# Altium schematic sheet Sheet4_Matrix.SchDoc
size A0
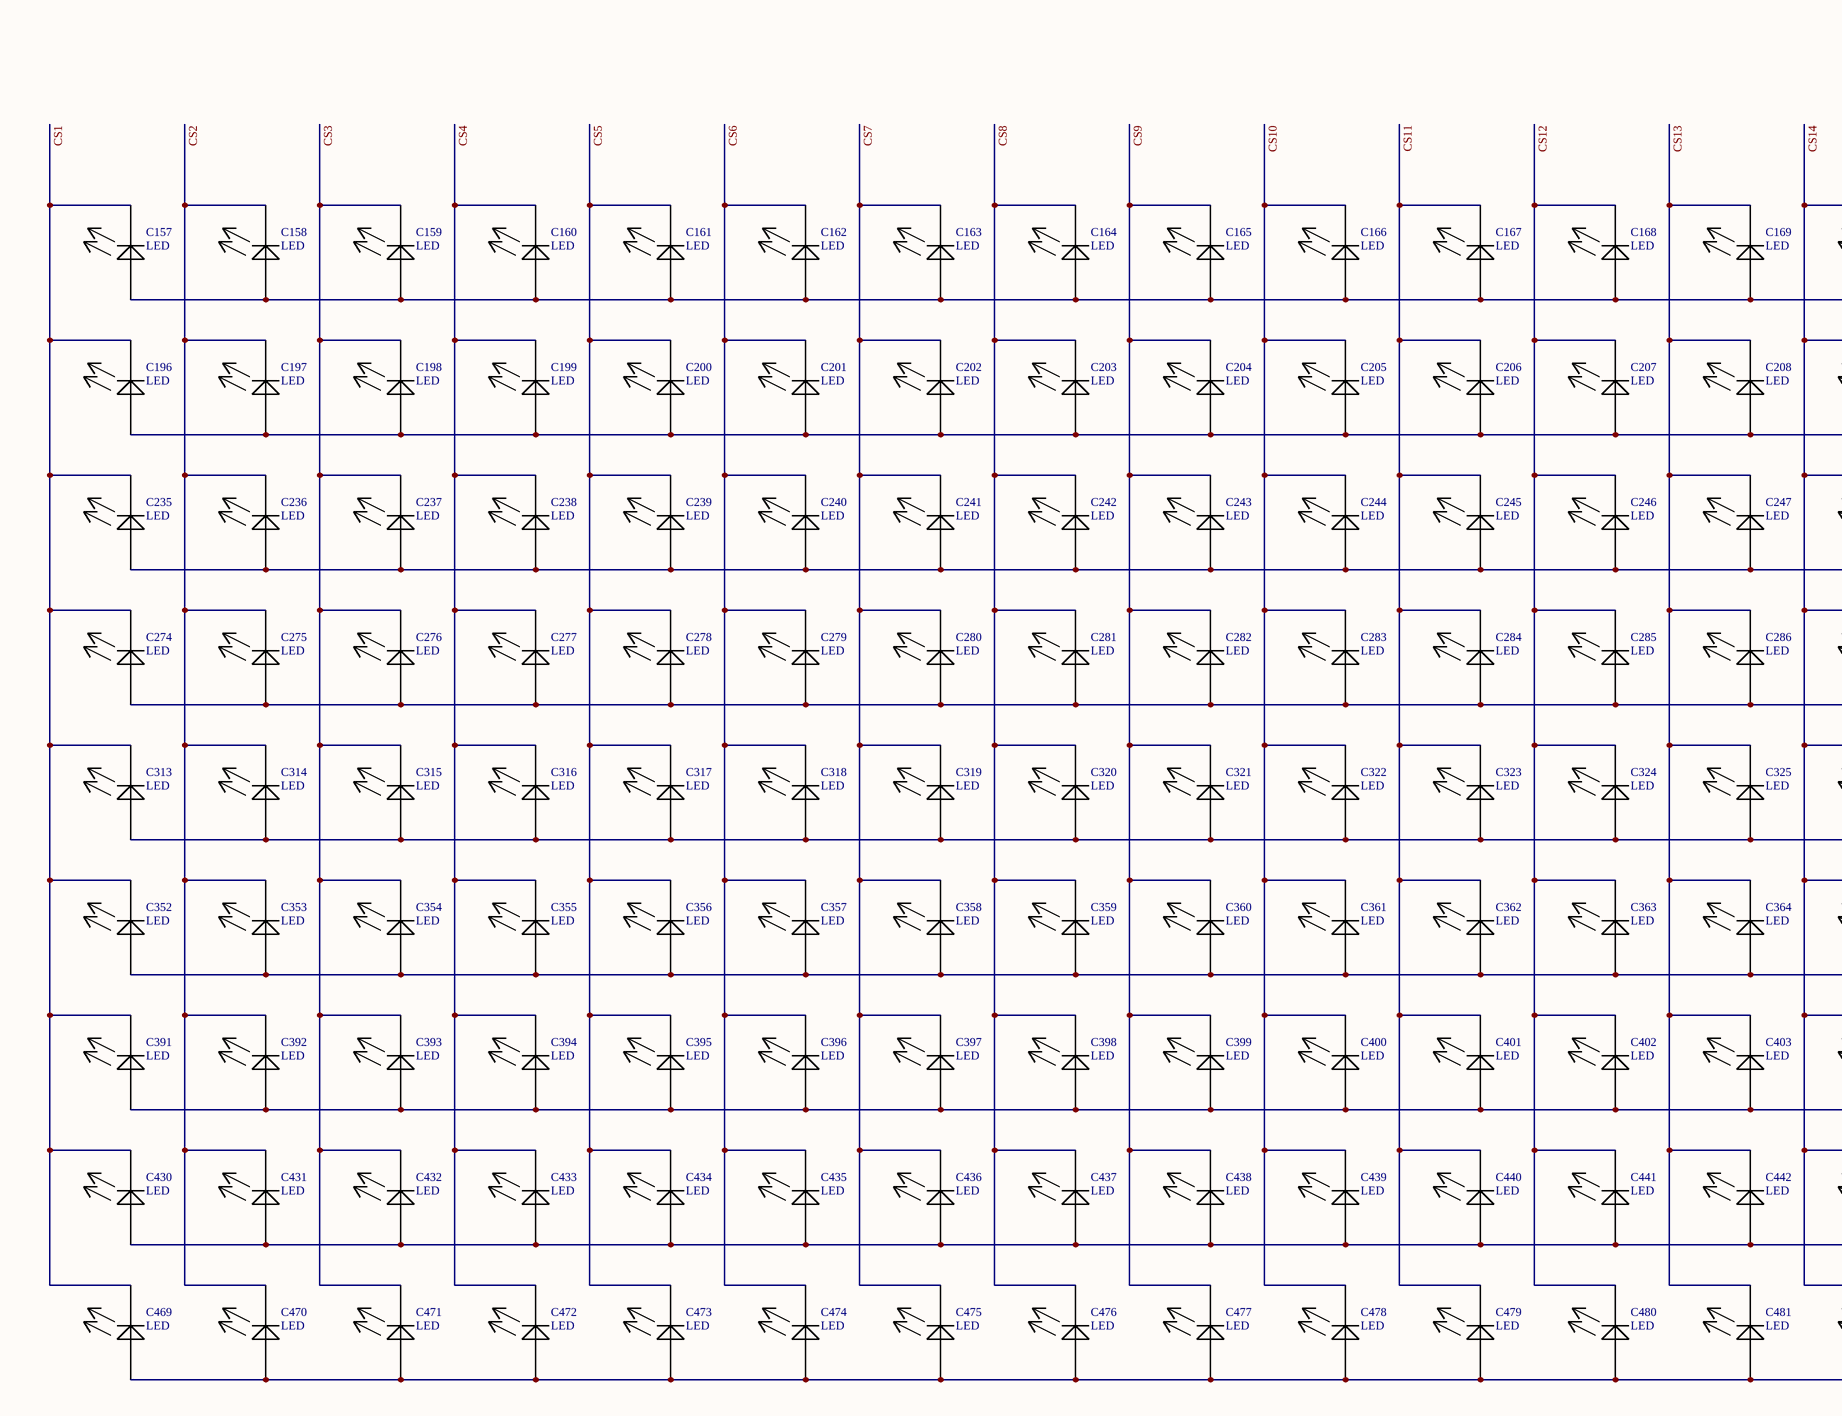
[diagram p0: Sheet4_Matrix.SchDoc, left]
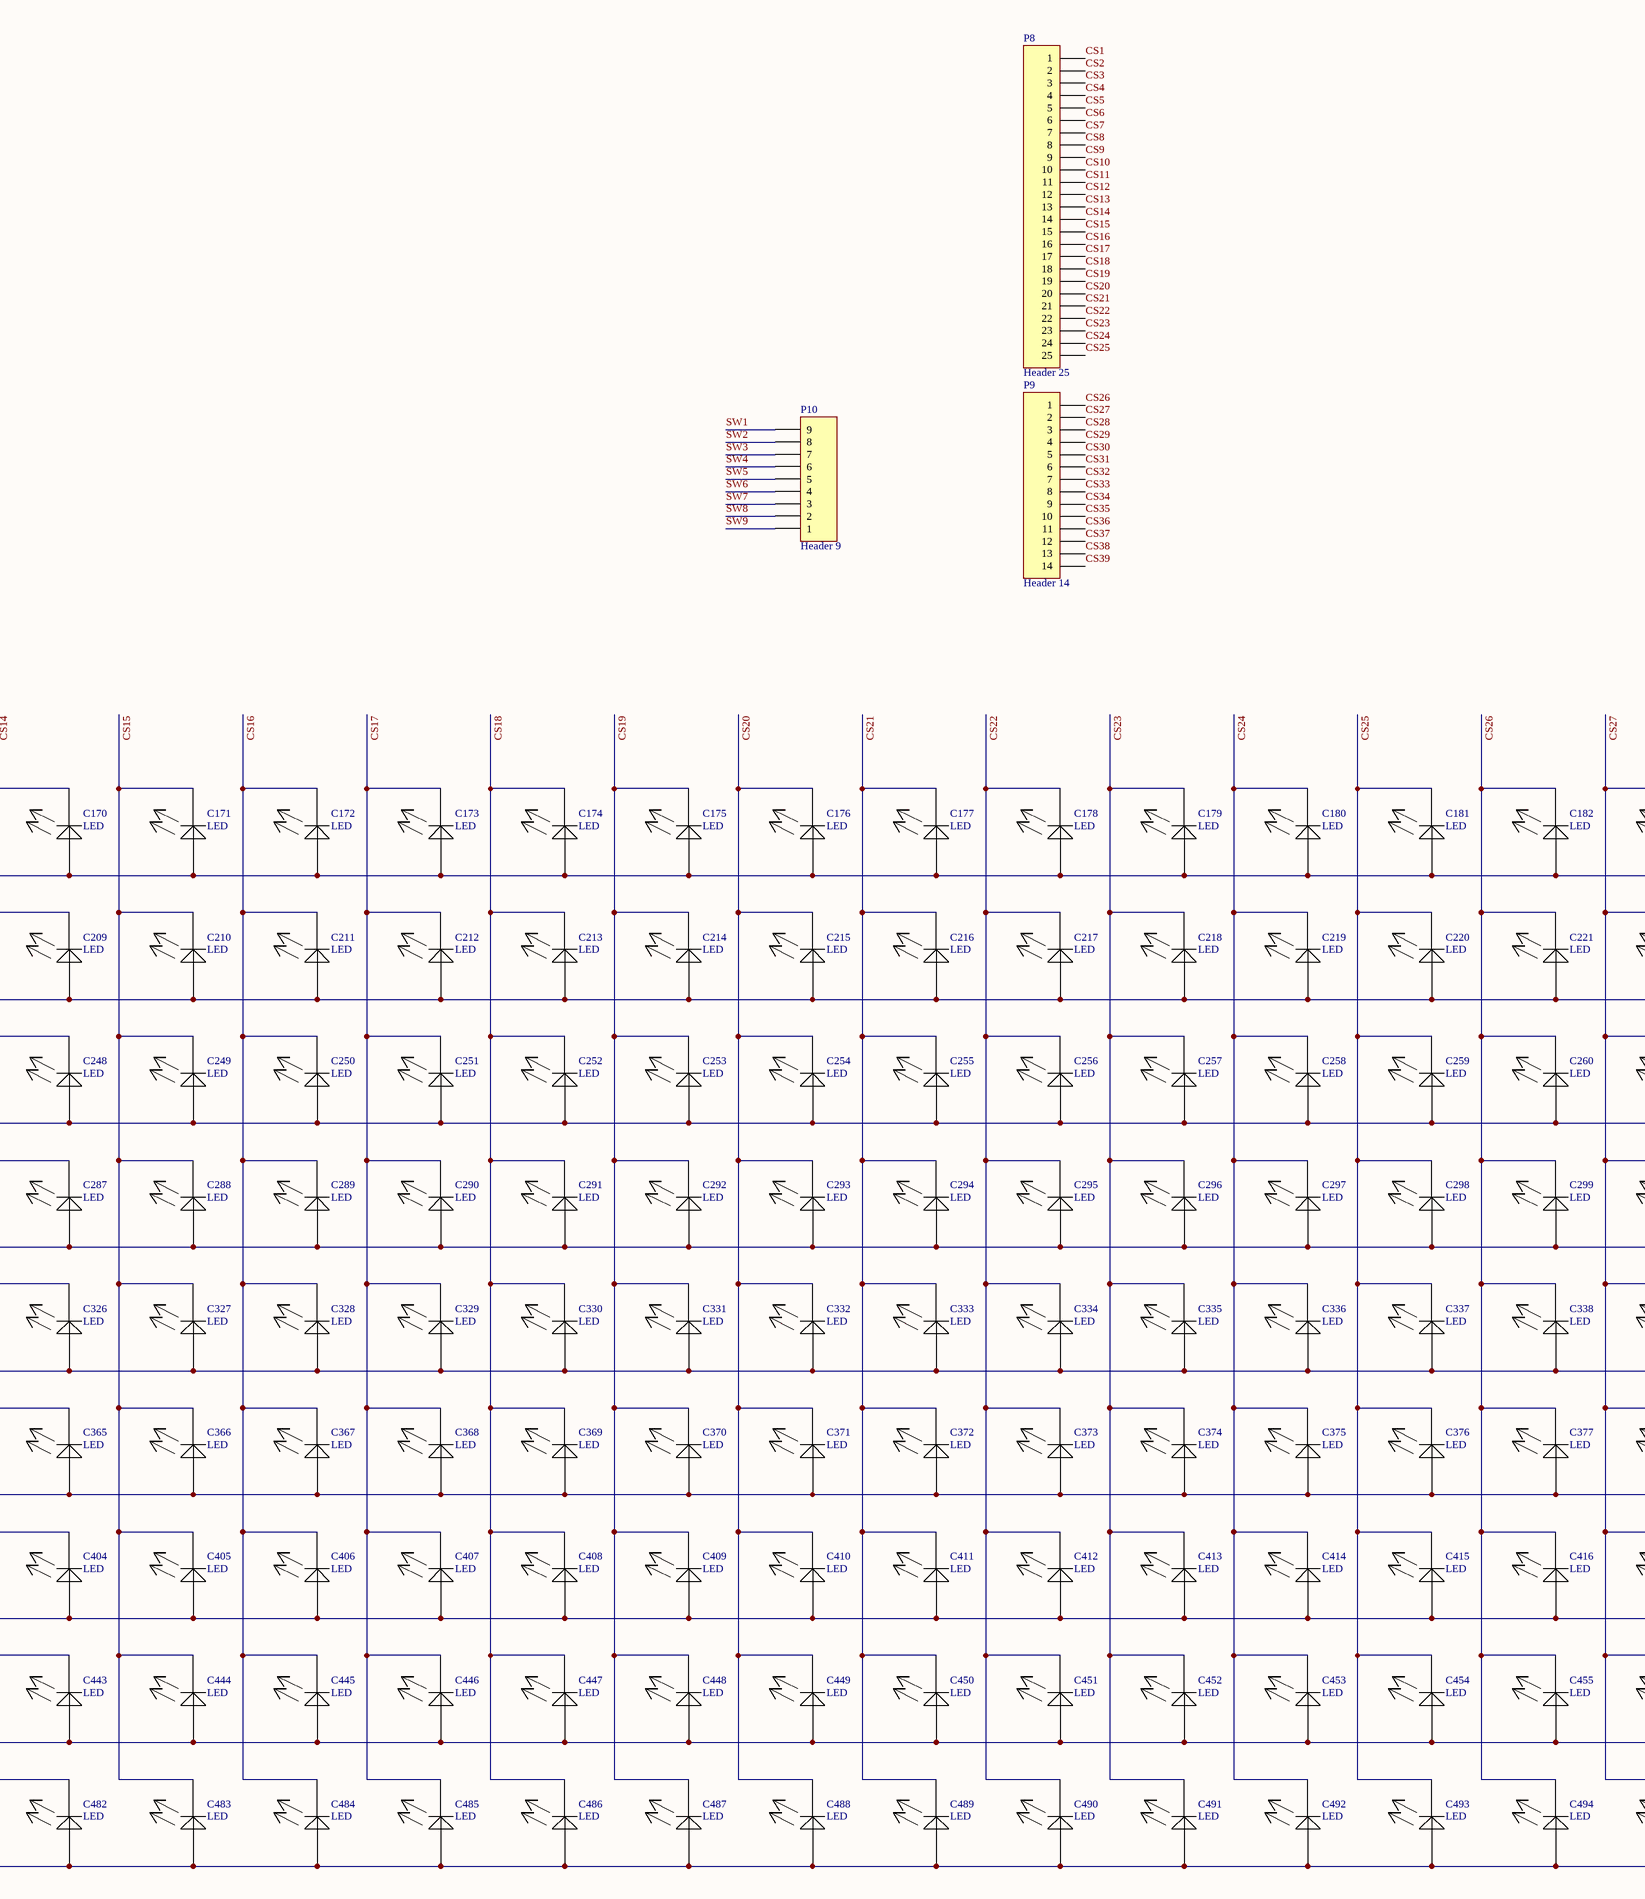
[diagram p1: Sheet4_Matrix.SchDoc, middle]
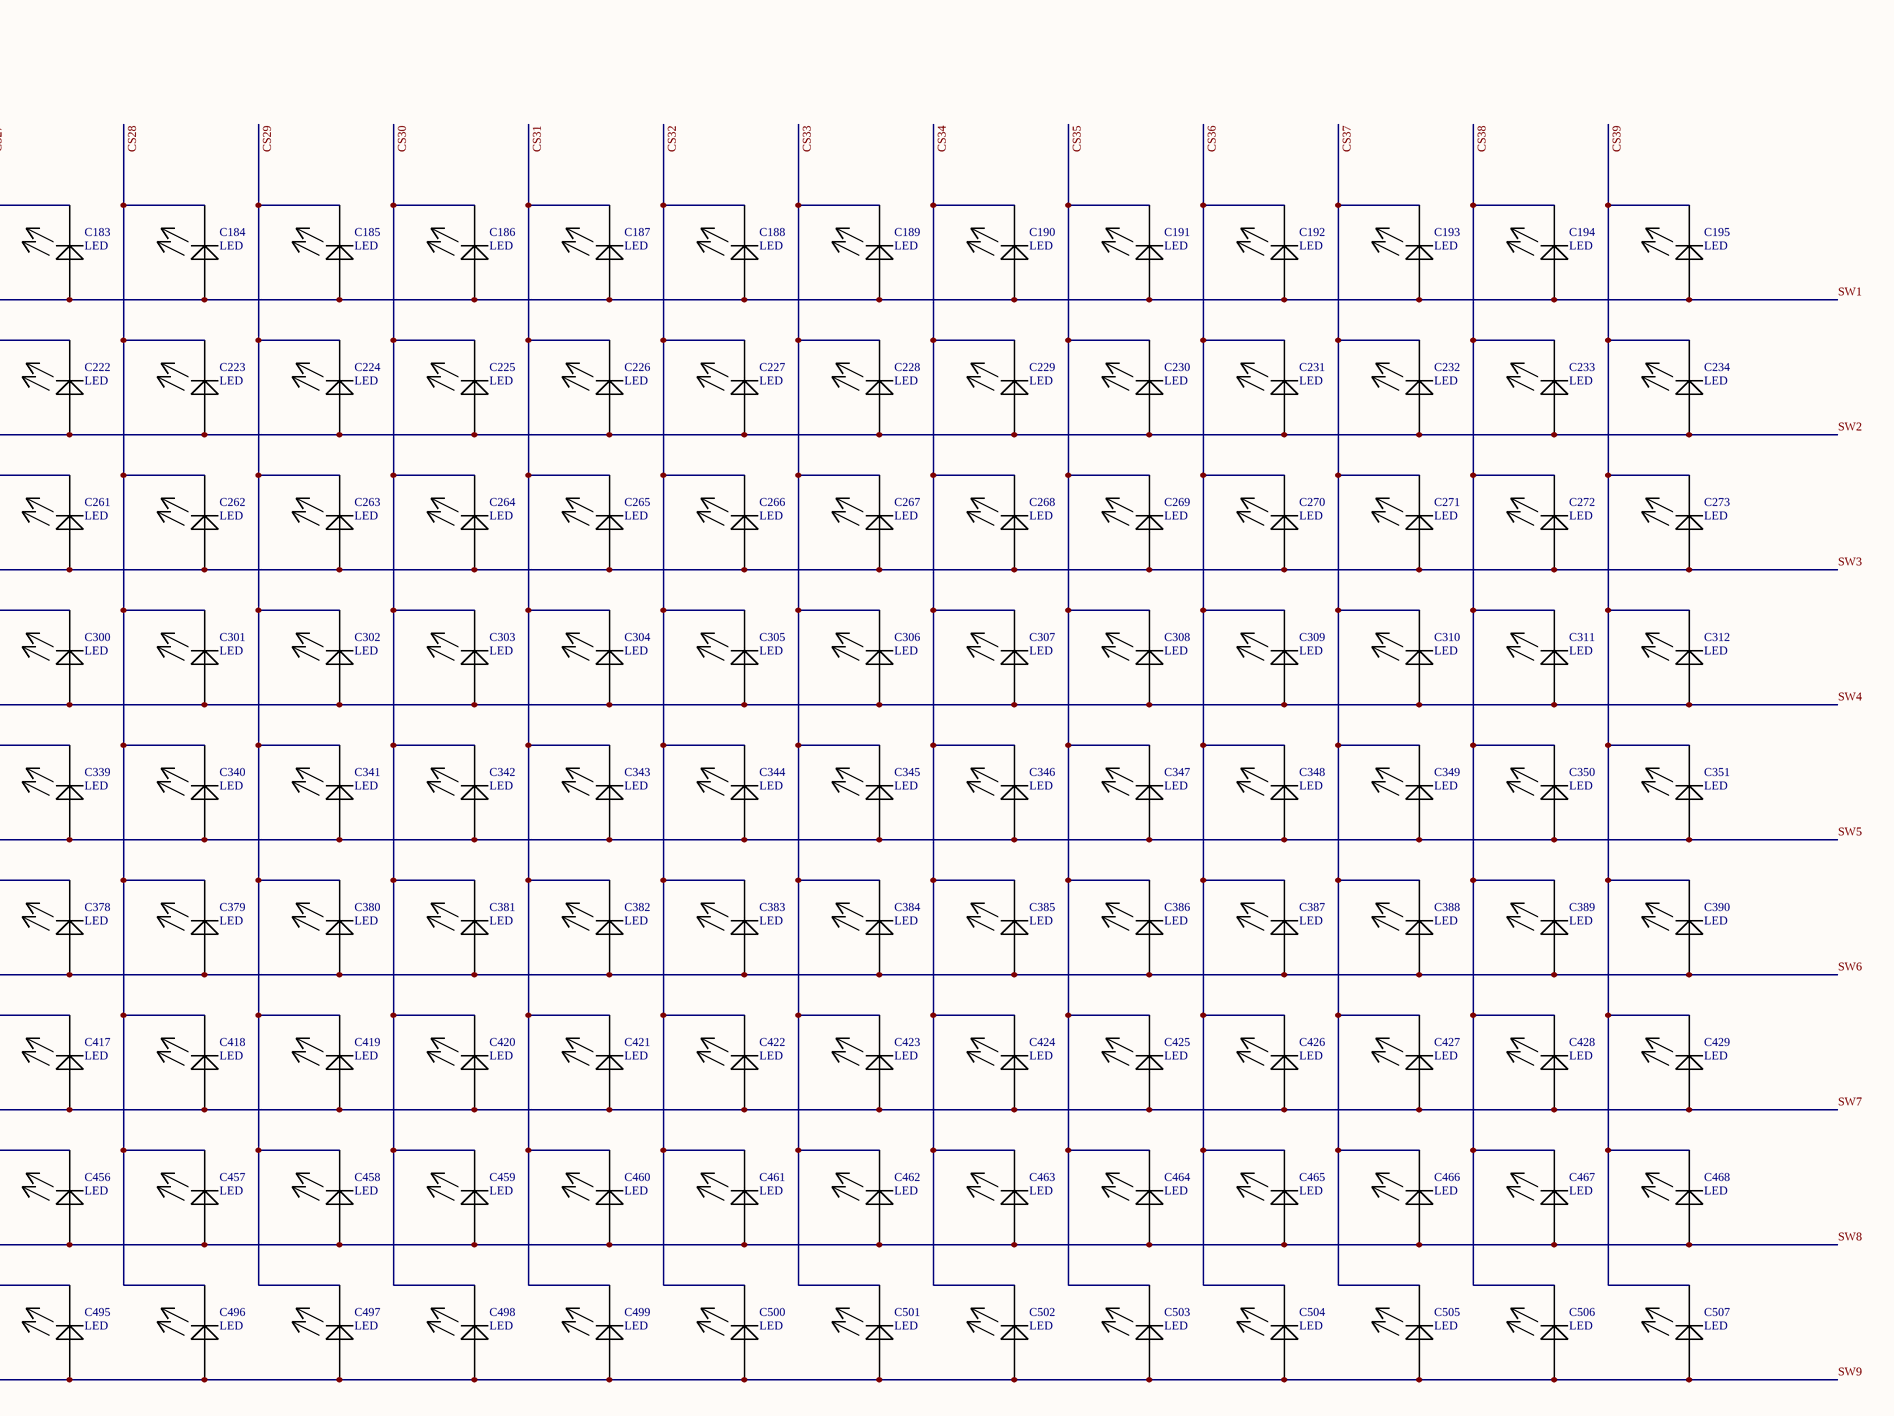
[diagram p2: Sheet4_Matrix.SchDoc, right]

## Parts
C157  LED  [LED 0603(2)]
C158  LED  [LED 0603(2)]
C159  LED  [LED 0603(2)]
C160  LED  [LED 0603(2)]
C161  LED  [LED 0603(2)]
C162  LED  [LED 0603(2)]
C163  LED  [LED 0603(2)]
C164  LED  [LED 0603(2)]
C165  LED  [LED 0603(2)]
C166  LED  [LED 0603(2)]
C167  LED  [LED 0603(2)]
C168  LED  [LED 0603(2)]
C169  LED  [LED 0603(2)]
C170  LED  [LED 0603(2)]
C171  LED  [LED 0603(2)]
C172  LED  [LED 0603(2)]
C173  LED  [LED 0603(2)]
C174  LED  [LED 0603(2)]
C175  LED  [LED 0603(2)]
C176  LED  [LED 0603(2)]
C177  LED  [LED 0603(2)]
C178  LED  [LED 0603(2)]
C179  LED  [LED 0603(2)]
C180  LED  [LED 0603(2)]
C181  LED  [LED 0603(2)]
C182  LED  [LED 0603(2)]
C183  LED  [LED 0603(2)]
C184  LED  [LED 0603(2)]
C185  LED  [LED 0603(2)]
C186  LED  [LED 0603(2)]
C187  LED  [LED 0603(2)]
C188  LED  [LED 0603(2)]
C189  LED  [LED 0603(2)]
C190  LED  [LED 0603(2)]
C191  LED  [LED 0603(2)]
C192  LED  [LED 0603(2)]
C193  LED  [LED 0603(2)]
C194  LED  [LED 0603(2)]
C195  LED  [LED 0603(2)]
C196  LED  [LED 0603(2)]
C197  LED  [LED 0603(2)]
C198  LED  [LED 0603(2)]
C199  LED  [LED 0603(2)]
C200  LED  [LED 0603(2)]
C201  LED  [LED 0603(2)]
C202  LED  [LED 0603(2)]
C203  LED  [LED 0603(2)]
C204  LED  [LED 0603(2)]
C205  LED  [LED 0603(2)]
C206  LED  [LED 0603(2)]
C207  LED  [LED 0603(2)]
C208  LED  [LED 0603(2)]
C209  LED  [LED 0603(2)]
C210  LED  [LED 0603(2)]
C211  LED  [LED 0603(2)]
C212  LED  [LED 0603(2)]
C213  LED  [LED 0603(2)]
C214  LED  [LED 0603(2)]
C215  LED  [LED 0603(2)]
C216  LED  [LED 0603(2)]
C217  LED  [LED 0603(2)]
C218  LED  [LED 0603(2)]
C219  LED  [LED 0603(2)]
C220  LED  [LED 0603(2)]
C221  LED  [LED 0603(2)]
C222  LED  [LED 0603(2)]
C223  LED  [LED 0603(2)]
C224  LED  [LED 0603(2)]
C225  LED  [LED 0603(2)]
C226  LED  [LED 0603(2)]
C227  LED  [LED 0603(2)]
C228  LED  [LED 0603(2)]
C229  LED  [LED 0603(2)]
C230  LED  [LED 0603(2)]
C231  LED  [LED 0603(2)]
C232  LED  [LED 0603(2)]
C233  LED  [LED 0603(2)]
C234  LED  [LED 0603(2)]
C235  LED  [LED 0603(2)]
C236  LED  [LED 0603(2)]
C237  LED  [LED 0603(2)]
C238  LED  [LED 0603(2)]
C239  LED  [LED 0603(2)]
C240  LED  [LED 0603(2)]
C241  LED  [LED 0603(2)]
C242  LED  [LED 0603(2)]
C243  LED  [LED 0603(2)]
C244  LED  [LED 0603(2)]
C245  LED  [LED 0603(2)]
C246  LED  [LED 0603(2)]
C247  LED  [LED 0603(2)]
C248  LED  [LED 0603(2)]
C249  LED  [LED 0603(2)]
C250  LED  [LED 0603(2)]
C251  LED  [LED 0603(2)]
C252  LED  [LED 0603(2)]
C253  LED  [LED 0603(2)]
C254  LED  [LED 0603(2)]
C255  LED  [LED 0603(2)]
C256  LED  [LED 0603(2)]
C257  LED  [LED 0603(2)]
C258  LED  [LED 0603(2)]
C259  LED  [LED 0603(2)]
C260  LED  [LED 0603(2)]
C261  LED  [LED 0603(2)]
C262  LED  [LED 0603(2)]
C263  LED  [LED 0603(2)]
C264  LED  [LED 0603(2)]
C265  LED  [LED 0603(2)]
C266  LED  [LED 0603(2)]
C267  LED  [LED 0603(2)]
C268  LED  [LED 0603(2)]
C269  LED  [LED 0603(2)]
C270  LED  [LED 0603(2)]
C271  LED  [LED 0603(2)]
C272  LED  [LED 0603(2)]
C273  LED  [LED 0603(2)]
C274  LED  [LED 0603(2)]
C275  LED  [LED 0603(2)]
C276  LED  [LED 0603(2)]
C277  LED  [LED 0603(2)]
C278  LED  [LED 0603(2)]
C279  LED  [LED 0603(2)]
C280  LED  [LED 0603(2)]
C281  LED  [LED 0603(2)]
C282  LED  [LED 0603(2)]
C283  LED  [LED 0603(2)]
C284  LED  [LED 0603(2)]
C285  LED  [LED 0603(2)]
C286  LED  [LED 0603(2)]
C287  LED  [LED 0603(2)]
C288  LED  [LED 0603(2)]
C289  LED  [LED 0603(2)]
C290  LED  [LED 0603(2)]
C291  LED  [LED 0603(2)]
C292  LED  [LED 0603(2)]
C293  LED  [LED 0603(2)]
C294  LED  [LED 0603(2)]
C295  LED  [LED 0603(2)]
C296  LED  [LED 0603(2)]
C297  LED  [LED 0603(2)]
C298  LED  [LED 0603(2)]
C299  LED  [LED 0603(2)]
C300  LED  [LED 0603(2)]
C301  LED  [LED 0603(2)]
C302  LED  [LED 0603(2)]
C303  LED  [LED 0603(2)]
C304  LED  [LED 0603(2)]
C305  LED  [LED 0603(2)]
C306  LED  [LED 0603(2)]
C307  LED  [LED 0603(2)]
C308  LED  [LED 0603(2)]
C309  LED  [LED 0603(2)]
C310  LED  [LED 0603(2)]
C311  LED  [LED 0603(2)]
C312  LED  [LED 0603(2)]
C313  LED  [LED 0603(2)]
C314  LED  [LED 0603(2)]
C315  LED  [LED 0603(2)]
C316  LED  [LED 0603(2)]
C317  LED  [LED 0603(2)]
C318  LED  [LED 0603(2)]
C319  LED  [LED 0603(2)]
C320  LED  [LED 0603(2)]
C321  LED  [LED 0603(2)]
C322  LED  [LED 0603(2)]
C323  LED  [LED 0603(2)]
C324  LED  [LED 0603(2)]
C325  LED  [LED 0603(2)]
C326  LED  [LED 0603(2)]
C327  LED  [LED 0603(2)]
C328  LED  [LED 0603(2)]
C329  LED  [LED 0603(2)]
C330  LED  [LED 0603(2)]
C331  LED  [LED 0603(2)]
C332  LED  [LED 0603(2)]
C333  LED  [LED 0603(2)]
C334  LED  [LED 0603(2)]
C335  LED  [LED 0603(2)]
C336  LED  [LED 0603(2)]
C337  LED  [LED 0603(2)]
C338  LED  [LED 0603(2)]
C339  LED  [LED 0603(2)]
C340  LED  [LED 0603(2)]
C341  LED  [LED 0603(2)]
C342  LED  [LED 0603(2)]
C343  LED  [LED 0603(2)]
C344  LED  [LED 0603(2)]
C345  LED  [LED 0603(2)]
C346  LED  [LED 0603(2)]
C347  LED  [LED 0603(2)]
C348  LED  [LED 0603(2)]
C349  LED  [LED 0603(2)]
C350  LED  [LED 0603(2)]
C351  LED  [LED 0603(2)]
C352  LED  [LED 0603(2)]
C353  LED  [LED 0603(2)]
C354  LED  [LED 0603(2)]
C355  LED  [LED 0603(2)]
C356  LED  [LED 0603(2)]
C357  LED  [LED 0603(2)]
C358  LED  [LED 0603(2)]
C359  LED  [LED 0603(2)]
C360  LED  [LED 0603(2)]
C361  LED  [LED 0603(2)]
C362  LED  [LED 0603(2)]
C363  LED  [LED 0603(2)]
C364  LED  [LED 0603(2)]
C365  LED  [LED 0603(2)]
C366  LED  [LED 0603(2)]
C367  LED  [LED 0603(2)]
C368  LED  [LED 0603(2)]
C369  LED  [LED 0603(2)]
C370  LED  [LED 0603(2)]
C371  LED  [LED 0603(2)]
C372  LED  [LED 0603(2)]
C373  LED  [LED 0603(2)]
C374  LED  [LED 0603(2)]
C375  LED  [LED 0603(2)]
C376  LED  [LED 0603(2)]
C377  LED  [LED 0603(2)]
C378  LED  [LED 0603(2)]
C379  LED  [LED 0603(2)]
C380  LED  [LED 0603(2)]
C381  LED  [LED 0603(2)]
C382  LED  [LED 0603(2)]
C383  LED  [LED 0603(2)]
C384  LED  [LED 0603(2)]
C385  LED  [LED 0603(2)]
C386  LED  [LED 0603(2)]
C387  LED  [LED 0603(2)]
C388  LED  [LED 0603(2)]
C389  LED  [LED 0603(2)]
C390  LED  [LED 0603(2)]
C391  LED  [LED 0603(2)]
C392  LED  [LED 0603(2)]
C393  LED  [LED 0603(2)]
C394  LED  [LED 0603(2)]
C395  LED  [LED 0603(2)]
C396  LED  [LED 0603(2)]
C397  LED  [LED 0603(2)]
C398  LED  [LED 0603(2)]
C399  LED  [LED 0603(2)]
C400  LED  [LED 0603(2)]
C401  LED  [LED 0603(2)]
C402  LED  [LED 0603(2)]
C403  LED  [LED 0603(2)]
C404  LED  [LED 0603(2)]
C405  LED  [LED 0603(2)]
C406  LED  [LED 0603(2)]
C407  LED  [LED 0603(2)]
C408  LED  [LED 0603(2)]
C409  LED  [LED 0603(2)]
C410  LED  [LED 0603(2)]
C411  LED  [LED 0603(2)]
C412  LED  [LED 0603(2)]
C413  LED  [LED 0603(2)]
C414  LED  [LED 0603(2)]
C415  LED  [LED 0603(2)]
C416  LED  [LED 0603(2)]
C417  LED  [LED 0603(2)]
C418  LED  [LED 0603(2)]
C419  LED  [LED 0603(2)]
C420  LED  [LED 0603(2)]
C421  LED  [LED 0603(2)]
C422  LED  [LED 0603(2)]
C423  LED  [LED 0603(2)]
C424  LED  [LED 0603(2)]
C425  LED  [LED 0603(2)]
C426  LED  [LED 0603(2)]
C427  LED  [LED 0603(2)]
C428  LED  [LED 0603(2)]
C429  LED  [LED 0603(2)]
C430  LED  [LED 0603(2)]
C431  LED  [LED 0603(2)]
C432  LED  [LED 0603(2)]
C433  LED  [LED 0603(2)]
C434  LED  [LED 0603(2)]
C435  LED  [LED 0603(2)]
C436  LED  [LED 0603(2)]
C437  LED  [LED 0603(2)]
C438  LED  [LED 0603(2)]
C439  LED  [LED 0603(2)]
C440  LED  [LED 0603(2)]
C441  LED  [LED 0603(2)]
C442  LED  [LED 0603(2)]
C443  LED  [LED 0603(2)]
C444  LED  [LED 0603(2)]
C445  LED  [LED 0603(2)]
C446  LED  [LED 0603(2)]
C447  LED  [LED 0603(2)]
C448  LED  [LED 0603(2)]
C449  LED  [LED 0603(2)]
C450  LED  [LED 0603(2)]
C451  LED  [LED 0603(2)]
C452  LED  [LED 0603(2)]
C453  LED  [LED 0603(2)]
C454  LED  [LED 0603(2)]
C455  LED  [LED 0603(2)]
C456  LED  [LED 0603(2)]
C457  LED  [LED 0603(2)]
C458  LED  [LED 0603(2)]
C459  LED  [LED 0603(2)]
C460  LED  [LED 0603(2)]
C461  LED  [LED 0603(2)]
C462  LED  [LED 0603(2)]
C463  LED  [LED 0603(2)]
C464  LED  [LED 0603(2)]
C465  LED  [LED 0603(2)]
C466  LED  [LED 0603(2)]
C467  LED  [LED 0603(2)]
C468  LED  [LED 0603(2)]
C469  LED  [LED 0603(2)]
C470  LED  [LED 0603(2)]
C471  LED  [LED 0603(2)]
C472  LED  [LED 0603(2)]
C473  LED  [LED 0603(2)]
C474  LED  [LED 0603(2)]
C475  LED  [LED 0603(2)]
C476  LED  [LED 0603(2)]
C477  LED  [LED 0603(2)]
C478  LED  [LED 0603(2)]
C479  LED  [LED 0603(2)]
C480  LED  [LED 0603(2)]
C481  LED  [LED 0603(2)]
C482  LED  [LED 0603(2)]
C483  LED  [LED 0603(2)]
C484  LED  [LED 0603(2)]
C485  LED  [LED 0603(2)]
C486  LED  [LED 0603(2)]
C487  LED  [LED 0603(2)]
C488  LED  [LED 0603(2)]
C489  LED  [LED 0603(2)]
C490  LED  [LED 0603(2)]
C491  LED  [LED 0603(2)]
C492  LED  [LED 0603(2)]
C493  LED  [LED 0603(2)]
C494  LED  [LED 0603(2)]
C495  LED  [LED 0603(2)]
C496  LED  [LED 0603(2)]
C497  LED  [LED 0603(2)]
C498  LED  [LED 0603(2)]
C499  LED  [LED 0603(2)]
C500  LED  [LED 0603(2)]
C501  LED  [LED 0603(2)]
C502  LED  [LED 0603(2)]
C503  LED  [LED 0603(2)]
C504  LED  [LED 0603(2)]
C505  LED  [LED 0603(2)]
C506  LED  [LED 0603(2)]
C507  LED  [LED 0603(2)]
P8  Header 25  [HDR1X25]
P9  Header 14  [HDR1X14]
P10  Header 9  [HDR1X9]

## Nets
CS1: C157.2(-) C196.2(-) C235.2(-) C274.2(-) C313.2(-) C352.2(-) C391.2(-) C430.2(-) C469.2(-) P8.1
CS2: C158.2(-) C197.2(-) C236.2(-) C275.2(-) C314.2(-) C353.2(-) C392.2(-) C431.2(-) C470.2(-) P8.2
CS3: C159.2(-) C198.2(-) C237.2(-) C276.2(-) C315.2(-) C354.2(-) C393.2(-) C432.2(-) C471.2(-) P8.3
CS4: C160.2(-) C199.2(-) C238.2(-) C277.2(-) C316.2(-) C355.2(-) C394.2(-) C433.2(-) C472.2(-) P8.4
CS5: C161.2(-) C200.2(-) C239.2(-) C278.2(-) C317.2(-) C356.2(-) C395.2(-) C434.2(-) C473.2(-) P8.5
CS6: C162.2(-) C201.2(-) C240.2(-) C279.2(-) C318.2(-) C357.2(-) C396.2(-) C435.2(-) C474.2(-) P8.6
CS7: C163.2(-) C202.2(-) C241.2(-) C280.2(-) C319.2(-) C358.2(-) C397.2(-) C436.2(-) C475.2(-) P8.7
CS8: C164.2(-) C203.2(-) C242.2(-) C281.2(-) C320.2(-) C359.2(-) C398.2(-) C437.2(-) C476.2(-) P8.8
CS9: C165.2(-) C204.2(-) C243.2(-) C282.2(-) C321.2(-) C360.2(-) C399.2(-) C438.2(-) C477.2(-) P8.9
CS10: C166.2(-) C205.2(-) C244.2(-) C283.2(-) C322.2(-) C361.2(-) C400.2(-) C439.2(-) C478.2(-) P8.10
CS11: C167.2(-) C206.2(-) C245.2(-) C284.2(-) C323.2(-) C362.2(-) C401.2(-) C440.2(-) C479.2(-) P8.11
CS12: C168.2(-) C207.2(-) C246.2(-) C285.2(-) C324.2(-) C363.2(-) C402.2(-) C441.2(-) C480.2(-) P8.12
CS13: C169.2(-) C208.2(-) C247.2(-) C286.2(-) C325.2(-) C364.2(-) C403.2(-) C442.2(-) C481.2(-) P8.13
CS14: C170.2(-) C209.2(-) C248.2(-) C287.2(-) C326.2(-) C365.2(-) C404.2(-) C443.2(-) C482.2(-) P8.14
CS15: C171.2(-) C210.2(-) C249.2(-) C288.2(-) C327.2(-) C366.2(-) C405.2(-) C444.2(-) C483.2(-) P8.15
CS16: C172.2(-) C211.2(-) C250.2(-) C289.2(-) C328.2(-) C367.2(-) C406.2(-) C445.2(-) C484.2(-) P8.16
CS17: C173.2(-) C212.2(-) C251.2(-) C290.2(-) C329.2(-) C368.2(-) C407.2(-) C446.2(-) C485.2(-) P8.17
CS18: C174.2(-) C213.2(-) C252.2(-) C291.2(-) C330.2(-) C369.2(-) C408.2(-) C447.2(-) C486.2(-) P8.18
CS19: C175.2(-) C214.2(-) C253.2(-) C292.2(-) C331.2(-) C370.2(-) C409.2(-) C448.2(-) C487.2(-) P8.19
CS20: C176.2(-) C215.2(-) C254.2(-) C293.2(-) C332.2(-) C371.2(-) C410.2(-) C449.2(-) C488.2(-) P8.20
CS21: C177.2(-) C216.2(-) C255.2(-) C294.2(-) C333.2(-) C372.2(-) C411.2(-) C450.2(-) C489.2(-) P8.21
CS22: C178.2(-) C217.2(-) C256.2(-) C295.2(-) C334.2(-) C373.2(-) C412.2(-) C451.2(-) C490.2(-) P8.22
CS23: C179.2(-) C218.2(-) C257.2(-) C296.2(-) C335.2(-) C374.2(-) C413.2(-) C452.2(-) C491.2(-) P8.23
CS24: C180.2(-) C219.2(-) C258.2(-) C297.2(-) C336.2(-) C375.2(-) C414.2(-) C453.2(-) C492.2(-) P8.24
CS25: C181.2(-) C220.2(-) C259.2(-) C298.2(-) C337.2(-) C376.2(-) C415.2(-) C454.2(-) C493.2(-) P8.25
CS26: C182.2(-) C221.2(-) C260.2(-) C299.2(-) C338.2(-) C377.2(-) C416.2(-) C455.2(-) C494.2(-) P9.1
CS27: C183.2(-) C222.2(-) C261.2(-) C300.2(-) C339.2(-) C378.2(-) C417.2(-) C456.2(-) C495.2(-) P9.2
CS28: C184.2(-) C223.2(-) C262.2(-) C301.2(-) C340.2(-) C379.2(-) C418.2(-) C457.2(-) C496.2(-) P9.3
CS29: C185.2(-) C224.2(-) C263.2(-) C302.2(-) C341.2(-) C380.2(-) C419.2(-) C458.2(-) C497.2(-) P9.4
CS30: C186.2(-) C225.2(-) C264.2(-) C303.2(-) C342.2(-) C381.2(-) C420.2(-) C459.2(-) C498.2(-) P9.5
CS31: C187.2(-) C226.2(-) C265.2(-) C304.2(-) C343.2(-) C382.2(-) C421.2(-) C460.2(-) C499.2(-) P9.6
CS32: C188.2(-) C227.2(-) C266.2(-) C305.2(-) C344.2(-) C383.2(-) C422.2(-) C461.2(-) C500.2(-) P9.7
CS33: C189.2(-) C228.2(-) C267.2(-) C306.2(-) C345.2(-) C384.2(-) C423.2(-) C462.2(-) C501.2(-) P9.8
CS34: C190.2(-) C229.2(-) C268.2(-) C307.2(-) C346.2(-) C385.2(-) C424.2(-) C463.2(-) C502.2(-) P9.9
CS35: C191.2(-) C230.2(-) C269.2(-) C308.2(-) C347.2(-) C386.2(-) C425.2(-) C464.2(-) C503.2(-) P9.10
CS36: C192.2(-) C231.2(-) C270.2(-) C309.2(-) C348.2(-) C387.2(-) C426.2(-) C465.2(-) C504.2(-) P9.11
CS37: C193.2(-) C232.2(-) C271.2(-) C310.2(-) C349.2(-) C388.2(-) C427.2(-) C466.2(-) C505.2(-) P9.12
CS38: C194.2(-) C233.2(-) C272.2(-) C311.2(-) C350.2(-) C389.2(-) C428.2(-) C467.2(-) C506.2(-) P9.13
CS39: C195.2(-) C234.2(-) C273.2(-) C312.2(-) C351.2(-) C390.2(-) C429.2(-) C468.2(-) C507.2(-) P9.14
SW1: C157.1(+) C158.1(+) C159.1(+) C160.1(+) C161.1(+) C162.1(+) C163.1(+) C164.1(+) C165.1(+) C166.1(+) C167.1(+) C168.1(+) C169.1(+) C170.1(+) C171.1(+) C172.1(+) C173.1(+) C174.1(+) C175.1(+) C176.1(+) C177.1(+) C178.1(+) C179.1(+) C180.1(+) C181.1(+) C182.1(+) C183.1(+) C184.1(+) C185.1(+) C186.1(+) C187.1(+) C188.1(+) C189.1(+) C190.1(+) C191.1(+) C192.1(+) C193.1(+) C194.1(+) C195.1(+) P10.9
SW2: C196.1(+) C197.1(+) C198.1(+) C199.1(+) C200.1(+) C201.1(+) C202.1(+) C203.1(+) C204.1(+) C205.1(+) C206.1(+) C207.1(+) C208.1(+) C209.1(+) C210.1(+) C211.1(+) C212.1(+) C213.1(+) C214.1(+) C215.1(+) C216.1(+) C217.1(+) C218.1(+) C219.1(+) C220.1(+) C221.1(+) C222.1(+) C223.1(+) C224.1(+) C225.1(+) C226.1(+) C227.1(+) C228.1(+) C229.1(+) C230.1(+) C231.1(+) C232.1(+) C233.1(+) C234.1(+) P10.8
SW3: C235.1(+) C236.1(+) C237.1(+) C238.1(+) C239.1(+) C240.1(+) C241.1(+) C242.1(+) C243.1(+) C244.1(+) C245.1(+) C246.1(+) C247.1(+) C248.1(+) C249.1(+) C250.1(+) C251.1(+) C252.1(+) C253.1(+) C254.1(+) C255.1(+) C256.1(+) C257.1(+) C258.1(+) C259.1(+) C260.1(+) C261.1(+) C262.1(+) C263.1(+) C264.1(+) C265.1(+) C266.1(+) C267.1(+) C268.1(+) C269.1(+) C270.1(+) C271.1(+) C272.1(+) C273.1(+) P10.7
SW4: C274.1(+) C275.1(+) C276.1(+) C277.1(+) C278.1(+) C279.1(+) C280.1(+) C281.1(+) C282.1(+) C283.1(+) C284.1(+) C285.1(+) C286.1(+) C287.1(+) C288.1(+) C289.1(+) C290.1(+) C291.1(+) C292.1(+) C293.1(+) C294.1(+) C295.1(+) C296.1(+) C297.1(+) C298.1(+) C299.1(+) C300.1(+) C301.1(+) C302.1(+) C303.1(+) C304.1(+) C305.1(+) C306.1(+) C307.1(+) C308.1(+) C309.1(+) C310.1(+) C311.1(+) C312.1(+) P10.6
SW5: C313.1(+) C314.1(+) C315.1(+) C316.1(+) C317.1(+) C318.1(+) C319.1(+) C320.1(+) C321.1(+) C322.1(+) C323.1(+) C324.1(+) C325.1(+) C326.1(+) C327.1(+) C328.1(+) C329.1(+) C330.1(+) C331.1(+) C332.1(+) C333.1(+) C334.1(+) C335.1(+) C336.1(+) C337.1(+) C338.1(+) C339.1(+) C340.1(+) C341.1(+) C342.1(+) C343.1(+) C344.1(+) C345.1(+) C346.1(+) C347.1(+) C348.1(+) C349.1(+) C350.1(+) C351.1(+) P10.5
SW6: C352.1(+) C353.1(+) C354.1(+) C355.1(+) C356.1(+) C357.1(+) C358.1(+) C359.1(+) C360.1(+) C361.1(+) C362.1(+) C363.1(+) C364.1(+) C365.1(+) C366.1(+) C367.1(+) C368.1(+) C369.1(+) C370.1(+) C371.1(+) C372.1(+) C373.1(+) C374.1(+) C375.1(+) C376.1(+) C377.1(+) C378.1(+) C379.1(+) C380.1(+) C381.1(+) C382.1(+) C383.1(+) C384.1(+) C385.1(+) C386.1(+) C387.1(+) C388.1(+) C389.1(+) C390.1(+) P10.4
SW7: C391.1(+) C392.1(+) C393.1(+) C394.1(+) C395.1(+) C396.1(+) C397.1(+) C398.1(+) C399.1(+) C400.1(+) C401.1(+) C402.1(+) C403.1(+) C404.1(+) C405.1(+) C406.1(+) C407.1(+) C408.1(+) C409.1(+) C410.1(+) C411.1(+) C412.1(+) C413.1(+) C414.1(+) C415.1(+) C416.1(+) C417.1(+) C418.1(+) C419.1(+) C420.1(+) C421.1(+) C422.1(+) C423.1(+) C424.1(+) C425.1(+) C426.1(+) C427.1(+) C428.1(+) C429.1(+) P10.3
SW8: C430.1(+) C431.1(+) C432.1(+) C433.1(+) C434.1(+) C435.1(+) C436.1(+) C437.1(+) C438.1(+) C439.1(+) C440.1(+) C441.1(+) C442.1(+) C443.1(+) C444.1(+) C445.1(+) C446.1(+) C447.1(+) C448.1(+) C449.1(+) C450.1(+) C451.1(+) C452.1(+) C453.1(+) C454.1(+) C455.1(+) C456.1(+) C457.1(+) C458.1(+) C459.1(+) C460.1(+) C461.1(+) C462.1(+) C463.1(+) C464.1(+) C465.1(+) C466.1(+) C467.1(+) C468.1(+) P10.2
SW9: C469.1(+) C470.1(+) C471.1(+) C472.1(+) C473.1(+) C474.1(+) C475.1(+) C476.1(+) C477.1(+) C478.1(+) C479.1(+) C480.1(+) C481.1(+) C482.1(+) C483.1(+) C484.1(+) C485.1(+) C486.1(+) C487.1(+) C488.1(+) C489.1(+) C490.1(+) C491.1(+) C492.1(+) C493.1(+) C494.1(+) C495.1(+) C496.1(+) C497.1(+) C498.1(+) C499.1(+) C500.1(+) C501.1(+) C502.1(+) C503.1(+) C504.1(+) C505.1(+) C506.1(+) C507.1(+) P10.1

## Library data of the parts
P8 = Header 25: Header, 25-Pin; LatestRevisionDate: 17-Jul-2002; LatestRevisionNote: Re-released for DXP Platform.; Publisher: Altium Limited
P9 = Header 14: Header, 14-Pin; LatestRevisionDate: 17-Jul-2002; LatestRevisionNote: Re-released for DXP Platform.; Publisher: Altium Limited
P10 = Header 9: Header, 9-Pin; LatestRevisionDate: 17-Jul-2002; LatestRevisionNote: Re-released for DXP Platform.; Publisher: Altium Limited